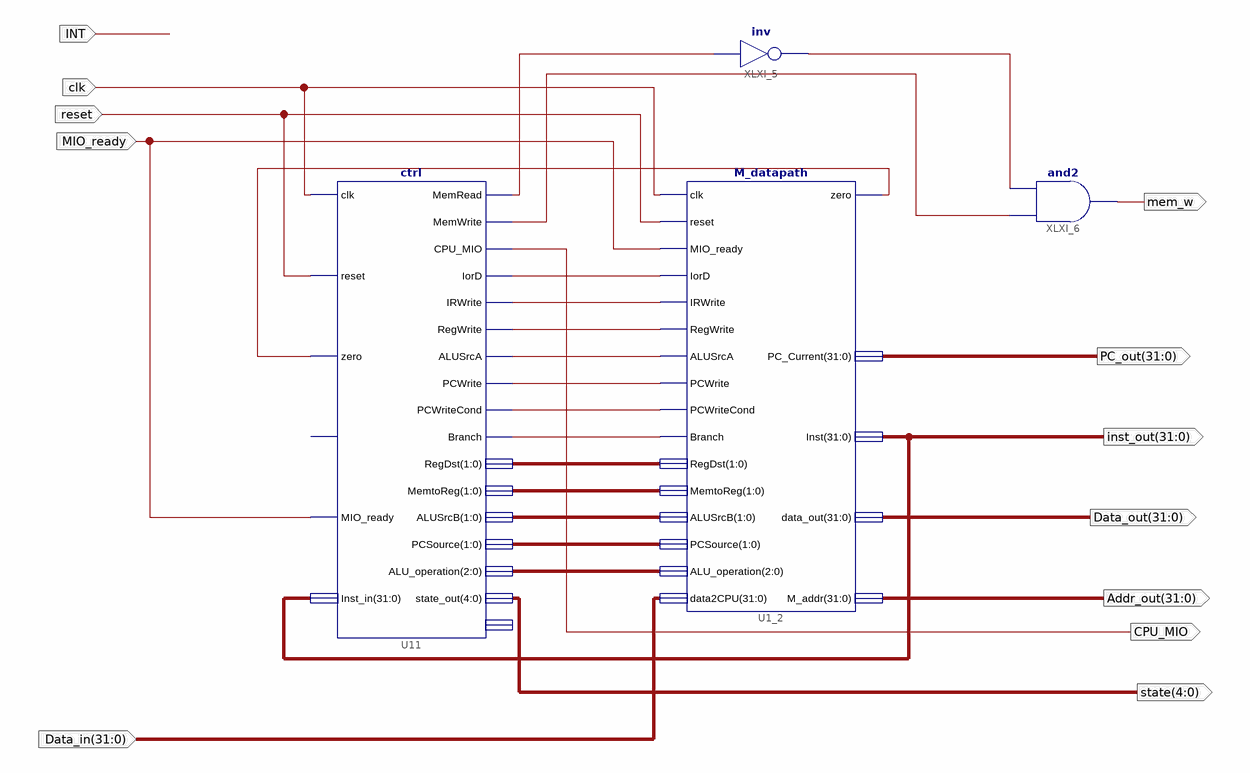
[diagram p0: schematic sheet 1]
// Xilinx ISE schematic MCPU.sch (kintex7) as structural Verilog: 4 symbols, 12 ports
module MCPU (
  input  clk,
  input  reset,
  input  MIO_ready,
  input  [31:0] Data_in,
  input  INT,
  output [31:0] inst_out,
  output CPU_MIO,
  output [31:0] PC_out,
  output [31:0] Data_out,
  output [31:0] Addr_out,
  output [4:0] state,
  output mem_w
);

  wire branch, XLXN_7, XLXN_8, XLXN_9, XLXN_10, XLXN_11, XLXN_12, XLXN_17, XLXN_39, XLXN_41, XLXN_42;
  wire [1:0] XLXN_3, XLXN_4, XLXN_6;
  wire [2:0] XLXN_2;

  ctrl U11 (
    .clk(clk), .reset(reset), .zero(XLXN_17), .MIO_ready(MIO_ready), .Inst_in(inst_out), .MemRead(XLXN_39),
    .MemWrite(XLXN_41), .CPU_MIO(CPU_MIO), .IorD(XLXN_12), .IRWrite(XLXN_11), .RegWrite(XLXN_10),
    .ALUSrcA(XLXN_9), .PCWrite(XLXN_8), .PCWriteCond(XLXN_7), .Branch(branch), .ALU_operation(XLXN_2),
    .state_out(state), .RegDst(XLXN_6), .MemtoReg(XLXN_4), .ALUSrcB(XLXN_3), .PCSource(XLXN_2[1:0]));  // open: overflow, ALUop
  M_datapath #(.VeriModel("M_datapath")) U1_2 (
    .reset(reset), .clk(clk), .IRWrite(XLXN_11), .data2CPU(Data_in), .RegDst(XLXN_6), .MemtoReg(XLXN_4),
    .RegWrite(XLXN_10), .ALUSrcA(XLXN_9), .ALUSrcB(XLXN_3), .ALU_operation(XLXN_2), .IorD(XLXN_12),
    .PCSource(XLXN_2[1:0]), .Branch(branch), .PCWriteCond(XLXN_7), .PCWrite(XLXN_8), .MIO_ready(MIO_ready),
    .Inst(inst_out), .data_out(Data_out), .zero(XLXN_17), .PC_Current(PC_out), .M_addr(Addr_out));
  not XLXI_5 (XLXN_42, XLXN_39);
  and XLXI_6 (mem_w, XLXN_41, XLXN_42);
endmodule
